# Altium schematic sheet LCD-Memory.SchDoc
size B; DocumentNumber: 5; SheetNumber: 5; SheetTotal: 9; ENG_APP_DATE: --/--/--; DSN_APP_DATE: --/--/--; CHK_APP_DATE: --/--/--
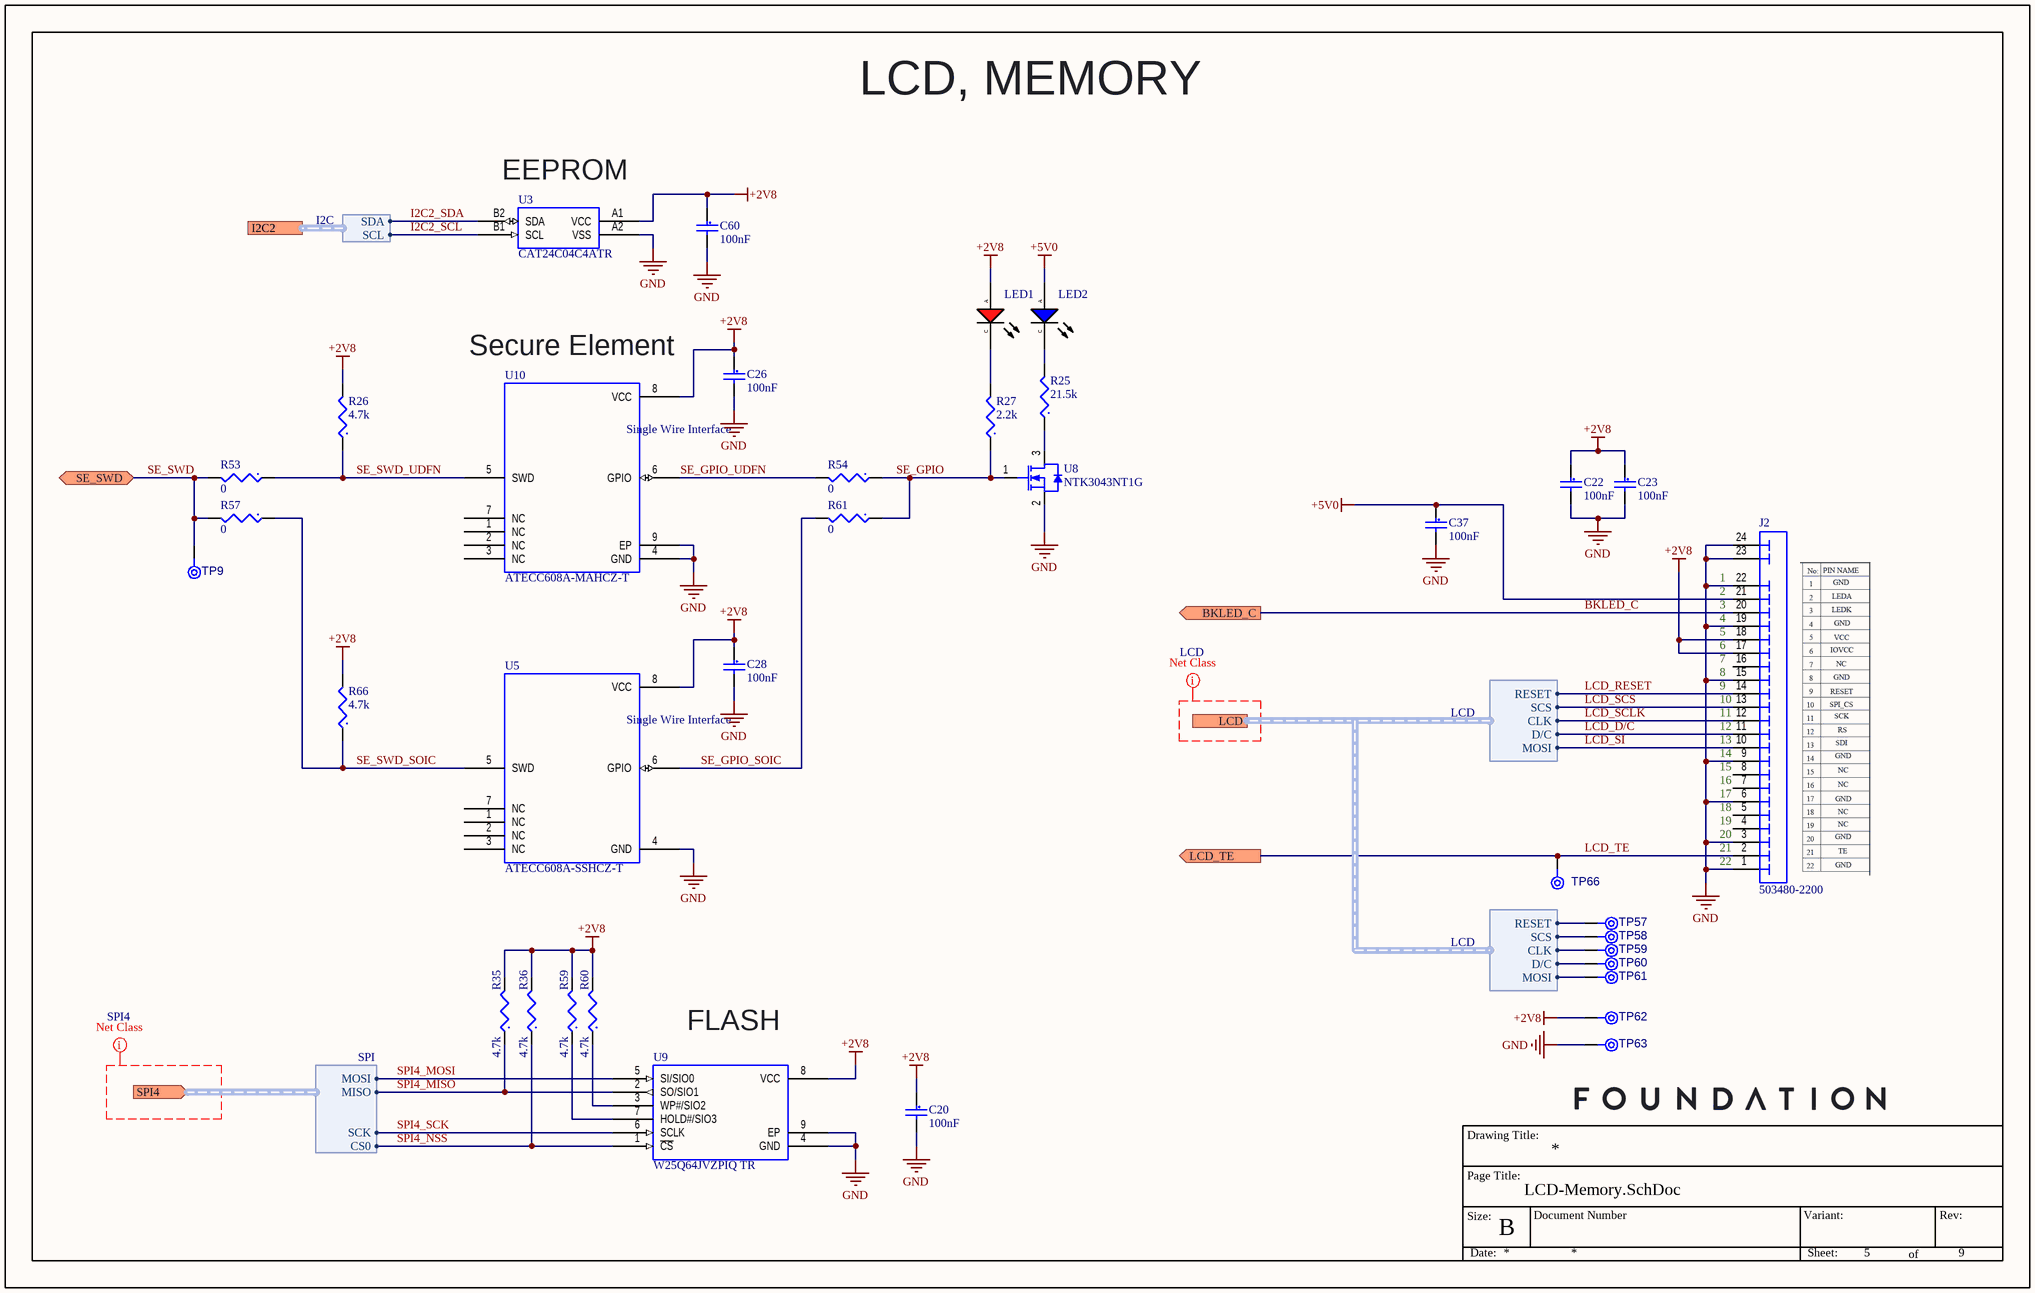
[diagram p0: LCD-Memory.SchDoc]

## Parts
C20  Capacitance: 100nF  [CAPC0402(1005)55_L]  (hidden comment: CAP CER 0.1uF 16V 10% X7R 0402)
C22  Capacitance: 100nF  [CAPC0402(1005)55_L]  (hidden comment: CAP CER 0.1uF 16V 10% X7R 0402)
C23  Capacitance: 100nF  [CAPC0402(1005)55_L]  (hidden comment: CAP CER 0.1uF 16V 10% X7R 0402)
C26  Capacitance: 100nF  [CAPC0402(1005)55_L]  (hidden comment: CAP CER 0.1uF 16V 10% X7R 0402)
C28  Capacitance: 100nF  [CAPC0402(1005)55_L]  (hidden comment: CAP CER 0.1uF 16V 10% X7R 0402)
C37  Capacitance: 100nF  [CAPC0402(1005)55_L]  (hidden comment: CAP CER 0.1uF 16V 10% X7R 0402)
C60  Capacitance: 100nF  [CAPC0402(1005)55_L]  (hidden comment: CAP CER 0.1uF 16V 10% X7R 0402)
J2  503480-2200  [MOLX - 503480-2200_V]
LED1  LTST-C191KRKT  [LEDC0603(1608)65_L]  (value not drawn)
LED2  KB DELPS2.DI-THVG-2J8L-Z555  [LEDC0603(1608)65_L]  (value not drawn)
R25  Resistance: 21.5k  [RESC0402(1005)_L]  (hidden comment: RES 21.5K 1/16W 1% 0402)
R26  Resistance: 4.7k  [RESC0402(1005)_L]  (hidden comment: RES 4.7K 1/16W 1% 0402)
R27  Resistance: 2.2k  [RESC0402(1005)_L]  (hidden comment: RES 2.2K 1/16W 1% 0402)
R35  Resistance: 4.7k  [RESC0402(1005)_L]  (hidden comment: RES 4.7K 1/16W 1% 0402)
R36  Resistance: 4.7k  [RESC0402(1005)_L]  (hidden comment: RES 4.7K 1/16W 1% 0402)
R53  Resistance: 0  [RESC0402(1005)_L]  (hidden comment: RES 0 OHM JUMPER 1/16W 0402)
R54  Resistance: 0  [RESC0402(1005)_L]  (hidden comment: RES 0 OHM JUMPER 1/16W 0402)
R57  Resistance: 0  [RESC0402(1005)_L]  (hidden comment: RES 0 OHM JUMPER 1/16W 0402)
R59  Resistance: 4.7k  [RESC0402(1005)_L]  (hidden comment: RES 4.7K 1/16W 1% 0402)
R60  Resistance: 4.7k  [RESC0402(1005)_L]  (hidden comment: RES 4.7K 1/16W 1% 0402)
R61  Resistance: 0  [RESC0402(1005)_L]  (hidden comment: RES 0 OHM JUMPER 1/16W 0402)
R66  Resistance: 4.7k  [RESC0402(1005)_L]  (hidden comment: RES 4.7K 1/16W 1% 0402)
TP9  TPAD8R  [TP08R]  (value not drawn)  (no BOM)
TP57  TPAD8R  [TP08R]  (value not drawn)  (no BOM)
TP58  TPAD8R  [TP08R]  (value not drawn)  (no BOM)
TP59  TPAD8R  [TP08R]  (value not drawn)  (no BOM)
TP60  TPAD8R  [TP08R]  (value not drawn)  (no BOM)
TP61  TPAD8R  [TP08R]  (value not drawn)  (no BOM)
TP62  TPAD8R  [TP08R]  (value not drawn)  (no BOM)
TP63  TPAD8R  [TP08R]  (value not drawn)  (no BOM)
TP66  TPAD8R  [TP08R]  (value not drawn)  (no BOM)
U3  CAT24C04C4ATR  [ON - WLCSP-4_V]
U5  ATECC608A-SSHCZ-T  [MCHP - SOIC-8_L]
U8  NTK3043NT1G  [SOT-723-3(40)_N]
U9  W25Q64JVZPIQ TR  [MXIC - WSON-8_L]
U10  ATECC608A-MAHCZ-T  [MCHP - UDFN-8_L]

## Ports
BKLED_C (out), I2C2 (harness I2C), LCD (harness LCD), LCD_TE (out), SE_SWD (bidir), SPI4 (in, harness SPI)

## Harnesses
LCD: CLK, SCS, MOSI, D/C, RESET
SPI: CS0, MISO, MOSI, SCK
I2C: SCL, SDA

## Nets
+2V8: C20.1 C22.1 C23.1 C26.1 C28.1 C60.1 J2.17 J2.18 LED1.A R26.2 R35.2 R36.2 R59.2 R60.2 R66.2 TP62.1(TP) U3.A1(VCC) U5.8(VCC) U9.8(VCC) U10.8(VCC)
+5V0: C37.1 J2.21 LED2.A
GND: C20.2 C22.2 C23.2 C26.2 C28.2 C37.2 C60.2 J2.1 J2.3 J2.6 J2.9 J2.15 J2.19 J2.22 J2.23 J2.24 TP63.1(TP) U3.A2(VSS) U5.4(GND) U8.2(S) U9.4(GND) U9.9(EP) U10.4(GND) U10.9(EP)
BKLED_C: J2.20 ; port BKLED_C
I2C2_SCL: U3.B1(SCL) ; port I2C2.SCL
I2C2_SDA: U3.B2(SDA) ; port I2C2.SDA
LCD_D/C: J2.11 TP60.1(TP) ; port LCD.D/C
LCD_RESET: J2.14 TP57.1(TP) ; port LCD.RESET
LCD_SCLK: J2.12 TP59.1(TP) ; port LCD.CLK
LCD_SCS: J2.13 TP58.1(TP) ; port LCD.SCS
LCD_SI: J2.10 TP61.1(TP) ; port LCD.MOSI
LCD_TE: J2.2 TP66.1(TP) ; port LCD_TE
SE_GPIO: R27.1 R54.1 R61.1 U8.1(G)
SE_GPIO_SOIC: R61.2 U5.6(GPIO)
SE_GPIO_UDFN: R54.2 U10.6(GPIO)
SE_SWD: R53.2 R57.2 TP9.1(TP) ; port SE_SWD
SE_SWD_SOIC: R57.1 R66.1 U5.5(SWD)
SE_SWD_UDFN: R26.1 R53.1 U10.5(SWD)
SPI4_MISO: R35.1 U9.2(SO/SIO1) ; port SPI4.MISO
SPI4_MOSI: U9.5(SI/SIO0) ; port SPI4.MOSI
SPI4_NSS: R36.1 U9.1(~{CS}) ; port SPI4.CS0
SPI4_SCK: U9.6(SCLK) ; port SPI4.SCK
NetLED1_C: LED1.C R27.2
NetLED2_C: LED2.C R25.2
NetR25_1: R25.1 U8.3(D)
NetR59_1: R59.1 U9.7(HOLD#/SIO3)
NetR60_1: R60.1 U9.3(WP#/SIO2)

Not connected (* = marked no-connect by the designer): J2 4 5 7 8 16; U5 1(NC) 2(NC) 3(NC) 7(NC); U10 1(NC) 2(NC) 3(NC) 7(NC)

## Layout directives
net class LCD: (no net found under the mark)
net class SPI4: (no net found under the mark)

## Notes on the sheet
- LCD, MEMORY
- (near U3) EEPROM
- (near U10) Secure Element
- (near J2) 1
- (near J2) 2
- (near J2) 3
- (near J2) 4
- (near J2) 5
- (near J2) 6
- (near J2) 7
- (near J2) 8
- (near J2) 9
- (near J2) 10
- (near J2) 11
- (near J2) 12
- (near J2) 13
- (near J2) 14
- (near J2) 15
- (near J2) 16
- (near J2) 17
- (near J2) 18
- (near J2) 19
- (near J2) 20
- (near J2) 21
- (near J2) 22
- (near U9) FLASH
- Drawing Title:
- Page Title:
- Size:
- B
- Document Number
- Variant:
- Rev:
- Date:
- Sheet:
- of
- (in symbol CMP-IC-MEM-0002-7) Single Wire Interface
- (in symbol CMP-IC-MEM-0020-1) Single Wire Interface

## Library data of the parts
C20 C22 C23 C26 C28 C37 C60 = CMP-CAP-00002-2: 0.1µF ±10% 16V Ceramic Capacitor X7R 0402 (1005 Metric); Insulation Resistance: 10GR; Material: Ceramic; Tolerance: 10%; REACH SVHC: No SVHC; Radiation Hardening: No; Case Code (Metric): 1005; Height: 0.5mm; Depth: 0.5mm; Min Operating Temperature: -55°C; Max Operating Temperature: 125°C; Lead Free: Lead Free; Thickness: 0.022inch; Length: 1mm; Voltage Rating (DC): 16V; Dielectric Material: Ceramic; Packaging: Tape and Reel; Case/Package: 0402; Width: 0.5mm; Termination: SMD/SMT; Voltage Rating: 16V; Mount: Surface Mount; Case Code (Imperial): 0402; Package Quantity: 1; Dielectric: X7R; Number of Pins: 2; Voltage: 16V
J2 = CMP-CON-0074-1: 22 Position FFC, FPC Connector Contacts, Top and Bottom 0.020" (0.50mm) Surface Mount, Right Angle; Body Length: 0.5inch; Plating Thickness: 39uin; Number of Rows Loaded: 1; Body Depth: 0.142inch; Contact Pattern: RECTANGULAR; Number of Contacts: 22; Reliability: COMMERCIAL; Body Breadth: 0.039inch; Connector Type: CARD EDGE CONNECTOR; Rated Current (Signal): 500mA; Mounting Option 1: LOCKING; Contact Style: BELLOWED TYPE; Mating Contact Pitch: 0.02inch; Insulation Color: White; Mounting Style: RIGHT ANGLE; Termination: SMD/SMT; Contact Finish - Mating: NOT SPECIFIED; REACH SVHC: Yes; Terminal Pitch: 0.508mm; Min Operating Temperature: -40°C; PCB Contact Pattern: RECTANGULAR; RoHS Compliant: Yes; Max Operating Temperature: 85°C; Number Of PCB Rows: 1; Insulation Material: Polymer; Mount: Board
LED1 = CMP-007-00039-8: Red 631nm LED Indication - Discrete 2V 0603 (1608 Metric); Viewing Angle: 130°; Test Current: 20mA; Number of LEDs: 1; Reverse Voltage: 5V; Power Rating: 75mW; Luminous Intensity: 54mcd; Lens Color: Colorless; Lens Style: Clear,Diffused,Colorless,Rectangular; Lens Transparency: Clear; Wavelength: 639nm; Forward Current: 30mA; Case/Package: 0603; Lead Free: Lead Free; Dominant Wavelength: 631nm; Forward Voltage: 2V; Depth: 0.8mm; Length: 1.6mm; Height: 0.55mm; Power Dissipation: 75mW; Voltage: 2V; Width: 0.8mm; Mount: Surface Mount; Illumination Color: Red; Case Code (Metric): 1608; Case Code (Imperial): 0603; Number of Pins: 2; Packaging: Tape and Reel; Max Operating Temperature: 85°C; Min Operating Temperature: -55°C; Radiation Hardening: No; Color: Red; Package Quantity: 1; Number of Elements: 1
LED2 = CMP-007-00045-4: Blue 466nm LED Indication - Discrete 2.8V 2-SMD 0603
R25 = CMP-RES-00073-1: 21.5 kOhms ±1% 0.063W, 1/16W Chip Resistor 0402 (1005 Metric); Voltage Rating: 50V; Temperature Coefficient: 100ppm/°C; Number of Terminals/Pins: 2; Reference Standard: AEC-Q200; Rated Temperature: 70°C; Package Height: 0.35mm; Rated Power Dissipation (P): 63mW; Package Width: 0.5mm; Package Length: 1mm; Max Operating Temperature: 155°C; Min Operating Temperature: -55°C; Tolerance: 1%; Termination: Wraparound; Packaging: Tape and Reel; Mount: Surface Mount; Working Voltage: 50V; Construction: Chip; Resistor Type: FIXED RESISTOR; Technology: METAL GLAZE/THICK FILM; JESD-609 Code: e3; Size Code: 0402; Terminal Finish: Nickel; Package Style: SMTMeter; Package Shape: Rectangular
R26 R35 R36 R59 R60 R66 = CMP-RES-00002-3: 4.7 kOhms ±1% 0.063W, 1/16W Chip Resistor 0402 (1005 Metric) Automotive AEC-Q200 Thick Film; Max Power Dissipation: 63mW; Voltage Rating (DC): 50V; Temperature Coefficient: 100ppm/°C; Weight: 2.3E-05oz; Package Quantity: 10; Military Standard: Not; Contact Plating: Tin; Termination: SMD/SMT; Max Operating Temperature: 155°C; Case Code (Metric): 1005; Case Code (Imperial): 0402; Features: Automotive AEC-Q200; Power Rating: 63mW; REACH SVHC: Unknown; Min Operating Temperature: -55°C; Tolerance: 1%; Mount: Surface Mount; Width: 0.5mm; Depth: 0.5mm; Radiation Hardening: No; Length: 1mm; Number of Terminations: 2; Case/Package: 0402; Voltage Rating: 50V; Height: 0.35mm; Packaging: Tape and Reel; Lead Free: Lead Free; Composition: Thick Film
R27 = CMP-RES-00049-1: 2.2 kOhms ±1% 0.063W, 1/16W Chip Resistor 0402 (1005 Metric); Temperature Coefficient: 100ppm/°C; Voltage Rating: 50V; Power Rating: 63mW; Termination: SMD/SMT; Max Operating Temperature: 155°C; Height: 0.35mm; Length: 1mm; Case Code (Metric): 1005; REACH SVHC: Unknown; Case/Package: 0402; Weight: 2.3E-05oz; Composition: Thick Film; Min Operating Temperature: -55°C; Width: 0.5mm; Military Standard: Not; Case Code (Imperial): 0402; Depth: 0.5mm; Packaging: Tape and Reel; Lead Free: Lead Free; Tolerance: 1%
R53 R54 R57 R61 = CMP-RES-00014-4: 0 Ohms Jumper 0.063W, 1/16W Chip Resistor 0402 (1005 Metric); Temperature Coefficient: 200ppm/°C; Power Rating: 62.5mW; Max Power Dissipation: 63mW; Tolerance: 5%; Voltage Rating: 50V; Lead Free: Lead Free; Height: 0.016inch; Military Standard: Not; Max Operating Temperature: 155°C; Features: Moisture Resistant; Case/Package: 0402; Contact Plating: Tin,Matte; Composition: Thick Film; Number of Terminations: 2; Case Code (Imperial): 0402; Package Quantity: 1; REACH SVHC: Unknown; Radiation Hardening: No; Case Code (Metric): 1005; Width: 0.02inch; Termination: SMD/SMT; Min Operating Temperature: -55°C; Length: 1mm; Packaging: Tape and Reel; Depth: 0.5mm
TP9 TP57-TP63 TP66 = CMP-MECH-00011-2: 0.8mm round; Pins: 1
U3 = CMP-IC-MEM-0006-1: EEPROM Memory IC 4Kb (512 x 8) I²C 400kHz 900ns 4-WLCSP (0.84x0.86); Max Supply Voltage: 5.5V; Interface: I2C,Serial,2-Wire; Min Supply Voltage: 1.7V; Nominal Supply Current: 2mA; ComponentLink1Description: Datasheet; Max Operating Temperature: 85°C; Package Quantity: 5000; Mount: Surface Mount; Lead Free: Lead Free; Memory Size: 4KB; Density: 4Kb; Max Frequency: 400kHz; Radiation Hardening: No; Halogen Free: Halogen Free; Packaging: Tape and Reel; Number of Pins: 4; Memory Type: EEPROM; Frequency: 400kHz; Min Operating Temperature: -40°C; ComponentLink1URL: https://www.onsemi.com/pub/Collateral/CAT24C01-D.PDF; Access Time: 900ns
U5 = CMP-IC-MEM-0020-1: Cryptographic Co-Processor with Secure Hardware-Based Key Storage 1-Wire Interface 8-Pin SOIC T/R; Supply Voltage-Max (Vsup): 5.5V; Package Body Material: Plastic; Number of Functions: 1; Consumer IC Type: CONSUMER CIRCUIT; Number of Terminals/Pins: 8; Supply Voltage-Min (Vsup): 2V; Width: 3.9mm; Length: 4.9mm; JESD-30 Code: R-PDSO-G8; Temperature Grade: INDUSTRIAL; Terminal Form: Gull Wing; Case/Package: 8-UDFN (2x3); Height - Seated (Max): 1.75mm; Package Shape: Rectangular; Surface Mount: Yes; Package Style: SMALL OUTLINEMeter; Package Code: SOP; RoHS Compliant: No; REACH SVHC: Yes; Terminal Pitch: 1.27mm; Min Operating Temperature: -40°C; Technology: CMOS; Max Operating Temperature: 85°C; Terminal Position: DUAL
U8 = CMP-TRNST-0003-1: N-Channel 20V 210mA (Ta) 310mW (Ta) Surface Mount SOT-723; Power Dissipation: 440mW; Gate to Source Voltage (Vgs): 10V; Drain to Source Resistance: 3.4R; Input Capacitance: 11pF; Turn-On Delay Time: 13ns; Vgs(th) (Max) @ Id: 1.3V @ 250µA; Turn-Off Delay Time: 94ns; Rise Time: 15ns; Number of Elements: 1; Element Configuration: Single; Current Rating: 225mA; Threshold Voltage: 400mV; Max Operating Temperature: 150°C; Package Quantity: 1; Packaging: Tape and Reel; Continuous Drain Current (ID): 210mA; Pins: 3; Min Operating Temperature: -55°C; Vgs (Max): 10V; Drain to Source Breakdown Voltage: 20V; Radiation Hardening: No; Mounting Technology: Surface Mount; Drain to Source Voltage (Vdss): 20V; Number of Pins: 3; Max Power Dissipation: 310mW; Fall Time: 15ns; Case/Package: SOT-723-3; Transistor Type: N-Channel; Rds On Max: 3.4R; Lead Free: Lead Free; Height: 0.55mm; Contact Plating: Tin,Matte; On-State Resistance: 3.4R; Length: 1.25mm; REACH SVHC: No SVHC; Width: 0.85mm; Voltage Rating (DC): 20V
U9 = CMP-IC-MEM-0023-1: FLASH - NOR Memory IC 64Mb (8M x 8) SPI - Quad I/O 133 MHz 8-WSON (6x5); ComponentLink1Description: Datasheet; ComponentLink1URL: https://www.winbond.com/resource-files/w25q64jv%20revj%2003272018%20plus.pdf
U10 = CMP-IC-MEM-0002-7: Cryptographic Co-Processor with Secure Hardware-Based Key Storage 1-Wire Interface 8-Pin UDFN T/R; Case/Package: 8-UDFN (2x3)